# Altium schematic sheet [1] TSAL_Green.SchDoc
size A4
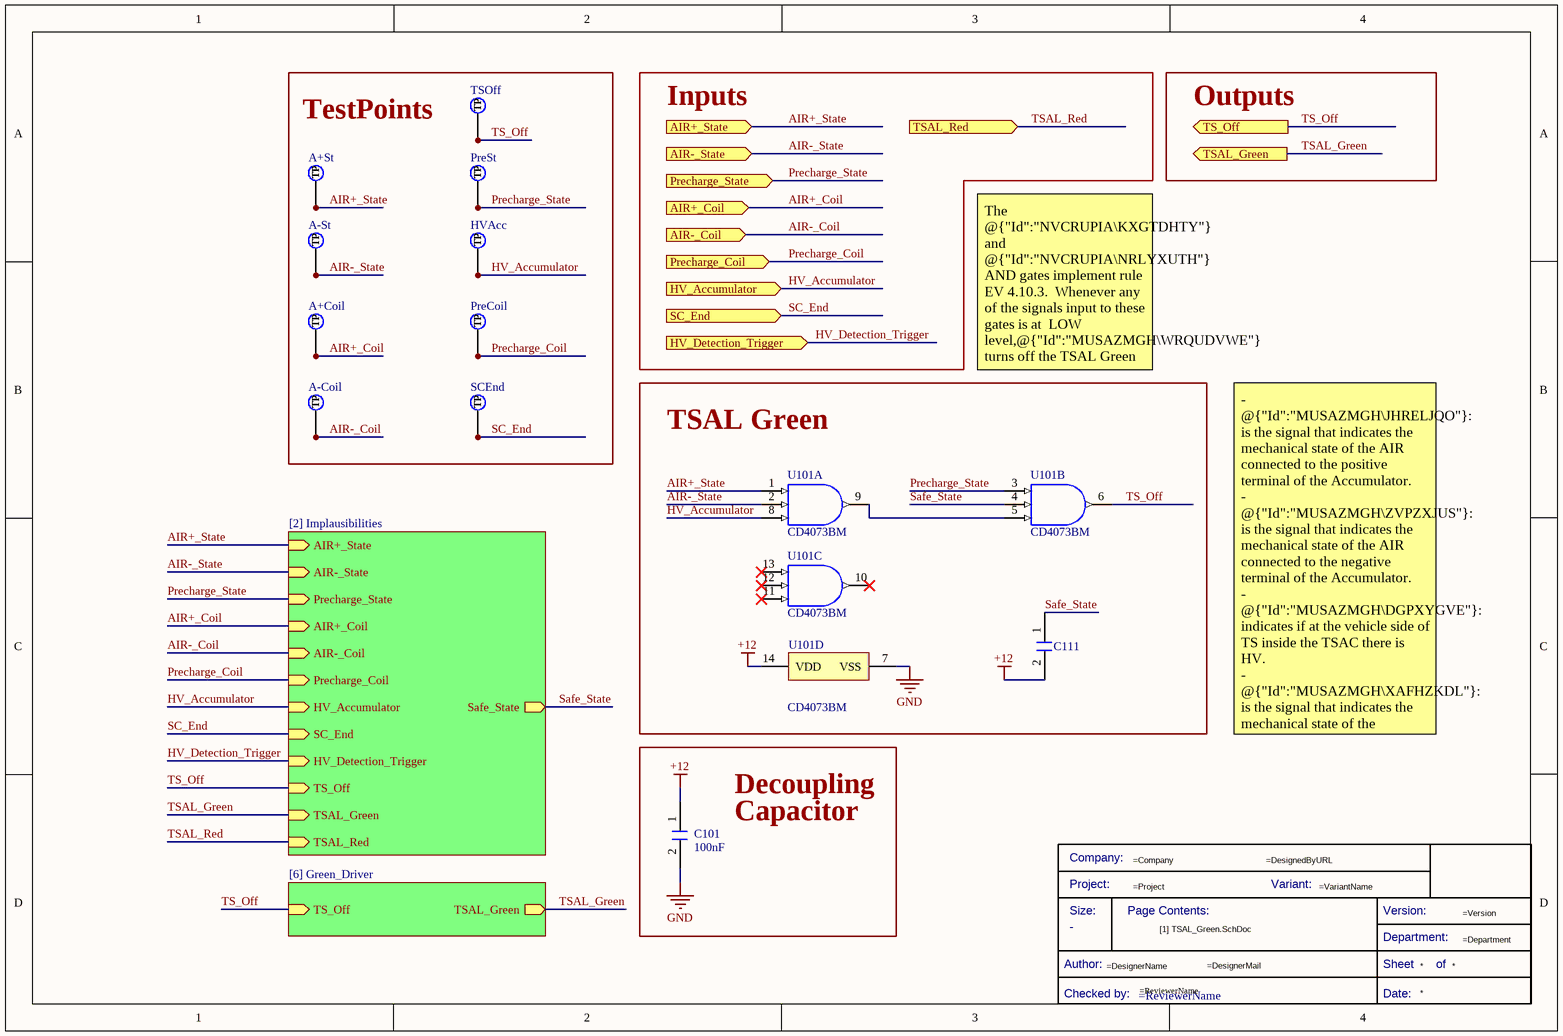
[diagram p0: [1] TSAL_Green.SchDoc]

## Parts
*  Title Block_template  (value not drawn)  (graphical)
A+Coil  TestPoint  [TestPoint]  (value not drawn)  (no BOM)
A+St  TestPoint  [TestPoint]  (value not drawn)  (no BOM)
A-Coil  TestPoint  [TestPoint]  (value not drawn)  (no BOM)
A-St  TestPoint  [TestPoint]  (value not drawn)  (no BOM)
C101  value 100nF  [C0805FNPC-R]  (hidden comment: C100n-50V-0805FNPC-X7R)
C111  C15p-50V-0805FNPC-NP0  [C0805FNPC-R]  (value not drawn)
HVAcc  TestPoint  [TestPoint]  (value not drawn)  (no BOM)
PreCoil  TestPoint  [TestPoint]  (value not drawn)  (no BOM)
PreSt  TestPoint  [TestPoint]  (value not drawn)  (no BOM)
SCEnd  TestPoint  [TestPoint]  (value not drawn)  (no BOM)
TSOff  TestPoint  [TestPoint]  (value not drawn)  (no BOM)
U101  CD4073BM  [D0014A_N]  (parts A,B,C,D of 4)

## Blocks framed on the sheet
TestPoints: A+Coil A+St A-Coil A-St HVAcc PreCoil PreSt SCEnd TSOff
TSAL Green: C111 U101

## Sub-sheets
Green Driver = [6] Green_Driver: TS_Off (in), TSAL_Green (out)
Implausibilities = [2] Implausibilities: AIR+_State (in), Precharge_State (in), AIR+_Coil (in), AIR-_Coil (in), Precharge_Coil (in), HV_Accumulator (in), Safe_State (out), SC_End (in), AIR-_State (in), HV_Detection_Trigger (in), TS_Off (in), TSAL_Green (in), TSAL_Red (in)

## Ports
AIR+_Coil (in, see TSAL_Control[1C], [2] Implausibilities[1A], [3] Relay Implausibility[1A], [4] NoHV_RelaysClosed[1A]), AIR+_State (in, see TSAL_Control[1B], [2] Implausibilities[1A], [3] Relay Implausibility[1A], [5] SCS[1A]), AIR-_Coil (in, see TSAL_Control[1C], [2] Implausibilities[1A], [3] Relay Implausibility[1A], [4] NoHV_RelaysClosed[1A]), AIR-_State (in, see TSAL_Control[1C], [2] Implausibilities[1A], [3] Relay Implausibility[1A], [5] SCS[1A]), HV_Accumulator (in, see TSAL_Control[1B], [2] Implausibilities[1A], [4] NoHV_RelaysClosed[1A], [5] SCS[1A]), HV_Detection_Trigger (in, see TSAL_Control[1C], [2] Implausibilities[1A], [5] SCS[1A], [7] TSAL_Red[2A]), Precharge_Coil (in, see TSAL_Control[1C], [2] Implausibilities[1A], [3] Relay Implausibility[1A], [4] NoHV_RelaysClosed[1A]), Precharge_State (in, see TSAL_Control[1C], [2] Implausibilities[1A], [3] Relay Implausibility[1A], [5] SCS[1A]), SC_End (in, see TSAL_Control[1C], [2] Implausibilities[1A], [3] Relay Implausibility[1B], [4] NoHV_RelaysClosed[1A]), TS_Off (out, see TSAL_Control[1C], [2] Implausibilities[1A], [5] SCS[1A], [6] Green_Driver[1A]), TSAL_Green (out, see TSAL_Control[1C], [2] Implausibilities[1A], [5] SCS[1A], [6] Green_Driver[2A]), TSAL_Red (in, see TSAL_Control[1C], [2] Implausibilities[1A], [5] SCS[1B], [7] TSAL_Red[2A], [8] Red_Driver[2A])

## Nets
+12: C101.1 C111.2 U101.14(VDD)
GND: C101.2 U101.7(VSS)
AIR+_Coil: A+Coil.1(TP) ; port AIR+_Coil, sheet Implausibilities/AIR+_Coil
AIR+_State: A+St.1(TP) U101.1(A) ; port AIR+_State, sheet Implausibilities/AIR+_State
AIR-_Coil: A-Coil.1(TP) ; port AIR-_Coil, sheet Implausibilities/AIR-_Coil
AIR-_State: A-St.1(TP) U101.2(B) ; port AIR-_State, sheet Implausibilities/AIR-_State
HV_Accumulator: HVAcc.1(TP) U101.8(C) ; port HV_Accumulator, sheet Implausibilities/HV_Accumulator
HV_Detection_Trigger: port HV_Detection_Trigger, sheet Implausibilities/HV_Detection_Trigger
Precharge_Coil: PreCoil.1(TP) ; port Precharge_Coil, sheet Implausibilities/Precharge_Coil
Precharge_State: PreSt.1(TP) U101.3(D) ; port Precharge_State, sheet Implausibilities/Precharge_State
Safe_State: C111.1 U101.4(E) ; sheet Implausibilities/Safe_State
SC_End: SCEnd.1(TP) ; port SC_End, sheet Implausibilities/SC_End
TS_Off: TSOff.1(TP) U101.6(K) ; port TS_Off, sheet Implausibilities/TS_Off, sheet Green Driver/TS_Off
TSAL_Green: port TSAL_Green, sheet Implausibilities/TSAL_Green, sheet Green Driver/TSAL_Green
TSAL_Red: port TSAL_Red, sheet Implausibilities/TSAL_Red
NetU101_5: U101.5(F) U101.9(J)

Not connected (* = marked no-connect by the designer): U101 10(L)* 11(I)* 12(H)* 13(G)*

## Notes on the sheet
- Inputs
- Outputs
- The @{"Id":"NVCRUPIA\KXGTDHTY"} and @{"Id":"NVCRUPIA\NRLYXUTH"} AND gates implement rule EV 4.10.3.  Whenever any of the signals input to these gates is at  LOW level,@{"Id":"MUSAZMGH\WRQUDVWE"} turns off the TSAL Green Light driver.
- - @{"Id":"MUSAZMGH\JHRELJQO"}: is the signal that indicates the mechanical state of the AIR connected to the positive terminal of the Accumulator.
  - @{"Id":"MUSAZMGH\ZVPZXJUS"}: is the signal that indicates the mechanical state of the AIR connected to the negative terminal of the Accumulator.
  - @{"Id":"MUSAZMGH\DGPXYGVE"}: indicates if at the vehicle side of TS inside the TSAC there is HV.
  - @{"Id":"MUSAZMGH\XAFHZKDL"}: is the signal that indicates the mechanical state of the Precharge relay connected to the positive terminal of the Accumulator and the Precharge resistor.
- Decoupling
- Capacitor
- (in symbol CMP-00043-8) Company:; Project:; Variant:; Size:; Page Contents:; Version:; Department:; Author:; Sheet; of; Checked by:; Date:

## Library data of the parts
* = CMP-00043-8: Standard Title Block; .SCHcheck: GP; Checked by:: =ReviewerName; Size: -; Design Item ID: Title Block_template; .PCBcheck: GP; .Creator: GP; Source: e-Tech_Racing.SchLib; Category: Title Block
A+Coil A+St A-Coil A-St HVAcc PreCoil PreSt SCEnd TSOff = CMP-00042-2: Test Point 1x1 mm; .SCHcheck: GP; Category: TestPoint; Source: e-Tech_Racing.SchLib; .Creator: GP; .PCBcheck: GP; Design Item ID: TestPoint
C101 = CMP-00063-3: Cap, 0.1ΜF, 50V, 10%, X7R, 0805; Manufacturer Part Number 1: 885012207098; Manufacturer 1: Wurth Electronics; .Creator: DR; ComponentLink2Description: http://www.farnell.com/datasheets/1958498.pdf?src-supplier=Element14; ComponentLink1Description: http://www.farnell.com/datasheets/1958498.pdf?src-supplier=Farnell; Thickness: 0.035inch; ComponentLink1URL: http://www.farnell.com/datasheets/1958498.pdf?src-supplier=Farnell; Min Operating Temperature: -55°C; Packaging: Cut Tape; ComponentLink2URL: http://www.farnell.com/datasheets/1958498.pdf?src-supplier=Element14; Mount: Surface Mount; Voltage Rating (DC): 50V; Tolerance: 10%; Category: Ceramic Capacitors; RoHS: Yes; Width: 0.049inch; Pricing 1: 100=0,10200, 500=0,07100, 2000=0,06100 (GBP); RoHS Compliant: Yes; ComponentLink4Description: http://www.farnell.com/datasheets/1958498.pdf?src-supplier=Newark; Dielectric: X7R; Stock 1: 8000; Length: 0.079inch; ComponentLink3URL: https://katalog.we-online.de/pbs/datasheet/885012207098.pdf?src-supplier=Digi-Key; ComponentLink3Description: https://katalog.we-online.de/pbs/datasheet/885012207098.pdf?src-supplier=Digi-Key; Design Item ID: C100n-50V-0805FNPC-X7R; ComponentLink4URL: http://www.farnell.com/datasheets/1958498.pdf?src-supplier=Newark; REACH SVHC: Unknown; Case Code (Metric): 2012; Voltage Rating: 50V; Max Operating Temperature: 125°C; Source: Passives.SchLib; Case/Package: 0805
C111 = CMP-00056-3: Cap, 15PF, 50V, 5%, C0G/NP0, 0805; Manufacturer Part Number 1: 885012007052; Manufacturer 1: Wurth Electronics; .Creator: DR; Thickness: 0.028inch; RoHS Compliant: Yes; ComponentLink2URL: http://katalog.we-online.de/pbs/datasheet/885012007052.pdf?src-supplier=Digi-Key; Design Item ID: C15p-50V-0805FNPC-NP0; Case Code (Metric): 2012; Max Operating Temperature: 125°C; Mount: Surface Mount; Category: Ceramic Capacitors; Min Operating Temperature: -55°C; Case/Package: 0805; ComponentLink3Description: https://katalog.we-online.de/pbs/datasheet/885012007052.pdf?src-supplier=Digi-Key; ComponentLink1Description: http://www.farnell.com/datasheets/2031702.pdf?src-supplier=Farnell; ComponentLink1URL: http://www.farnell.com/datasheets/2031702.pdf?src-supplier=Farnell; RoHS: Yes; Voltage Rating: 50V; Length: 0.079inch; Source: Passives.SchLib; Value: 15pF; Pricing 1: 1=0,10800, 10=0,05200, 25=0,05100, 50=0,04900, 100=0,04800, 250=0,04600, 500=0,04300 (USD); Tolerance: 5%; ComponentLink3URL: https://katalog.we-online.de/pbs/datasheet/885012007052.pdf?src-supplier=Digi-Key; Stock 1: 815; Packaging: Cut Tape; Width: 0.049inch; ComponentLink2Description: http://katalog.we-online.de/pbs/datasheet/885012007052.pdf?src-supplier=Digi-Key
U101 = CMP-00213-1: AND Gate, 4000/14000/40000 Series, 3-Func, 3-Input, CMOS, PDSO14; Propagation Delay (tpd): 250ns; Nominal Supply Voltage: 5V; Power Supplies: 5/15V; Qualification Status: Not Qualified; Package Equivalence Code: SOP14,.25; Channels: 3; Min Supply Voltage: 3V; Package Body Material: Plastic; Max Supply Voltage: 18V; Load Capacitance (CL): 50pF; Load/Preset Input: Yes; Schmitt Trigger: No; Terminal Pitch: 1.27mm; Terminal Form: Gull Wing; Length: 8.65mm; Logic Type: AND GATE; Prop. Delay@Nom-Sup: 250ns; Package Style: SMALL OUTLINEMeter; JESD-609 Code: e4; Package Shape: Rectangular; Moisture Sensitivity Level: 1; Max Operating Temperature: 125°C; Min Operating Temperature: -55°C; Case/Package: SOP; Terminal Finish: Nickel; Width: 3.9mm; Surface Mount: Yes; Reach SVHC Compliant: Yes; Technology: CMOS; Terminal Position: DUAL; Height - Seated (Max): 1.75mm; Temperature Grade: MILITARY; Number of Inputs: 3; Packaging: Rail/Tube; Pins: 14; Peak Reflow Temperature (Cel): 260°C; JESD-30 Code: R-PDSO-G14; RoHS Compliant: Yes